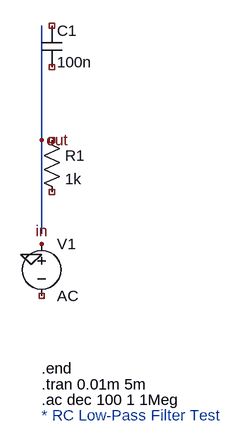
[diagram p0: schematic test_auto.asc]
test_auto.asc, the LTspice schematic file:
Version 4
SHEET 1 1200 880
SYMBOL voltage 64 480 R0
SYMATTR InstName V1
SYMATTR Value AC
SYMATTR Value2 1 SIN(0 1 1k)
SYMBOL res 64 320 R0
SYMATTR InstName R1
SYMATTR Value 1k
SYMBOL cap 64 160 R0
SYMATTR InstName C1
SYMATTR Value 100n
FLAG 64 496 in
FLAG 48 512 0
FLAG 64 336 out
WIRE 64 160 64 240
WIRE 64 320 64 240
WIRE 64 320 64 400
WIRE 64 480 64 400
TEXT 64 760 Left 2 ;* RC Low-Pass Filter Test
TEXT 64 736 Left 2 !.ac dec 100 1 1Meg
TEXT 64 712 Left 2 !.tran 0.01m 5m
TEXT 64 688 Left 2 !.end

The netlist it stands for:
* test_auto.asc
V1 in NC_01 AC 1 SIN(0 1 1k)
R1 NC_02 NC_03 1k
C1 NC_04 NC_05 100n
* * RC Low-Pass Filter Test
.ac dec 100 1 1Meg
.tran 0.01m 5m
.end
.backanno
.end